# Altium schematic sheet Quadrature Mixers.SchDoc
size B; SheetNumber: 5; SheetTotal: 7
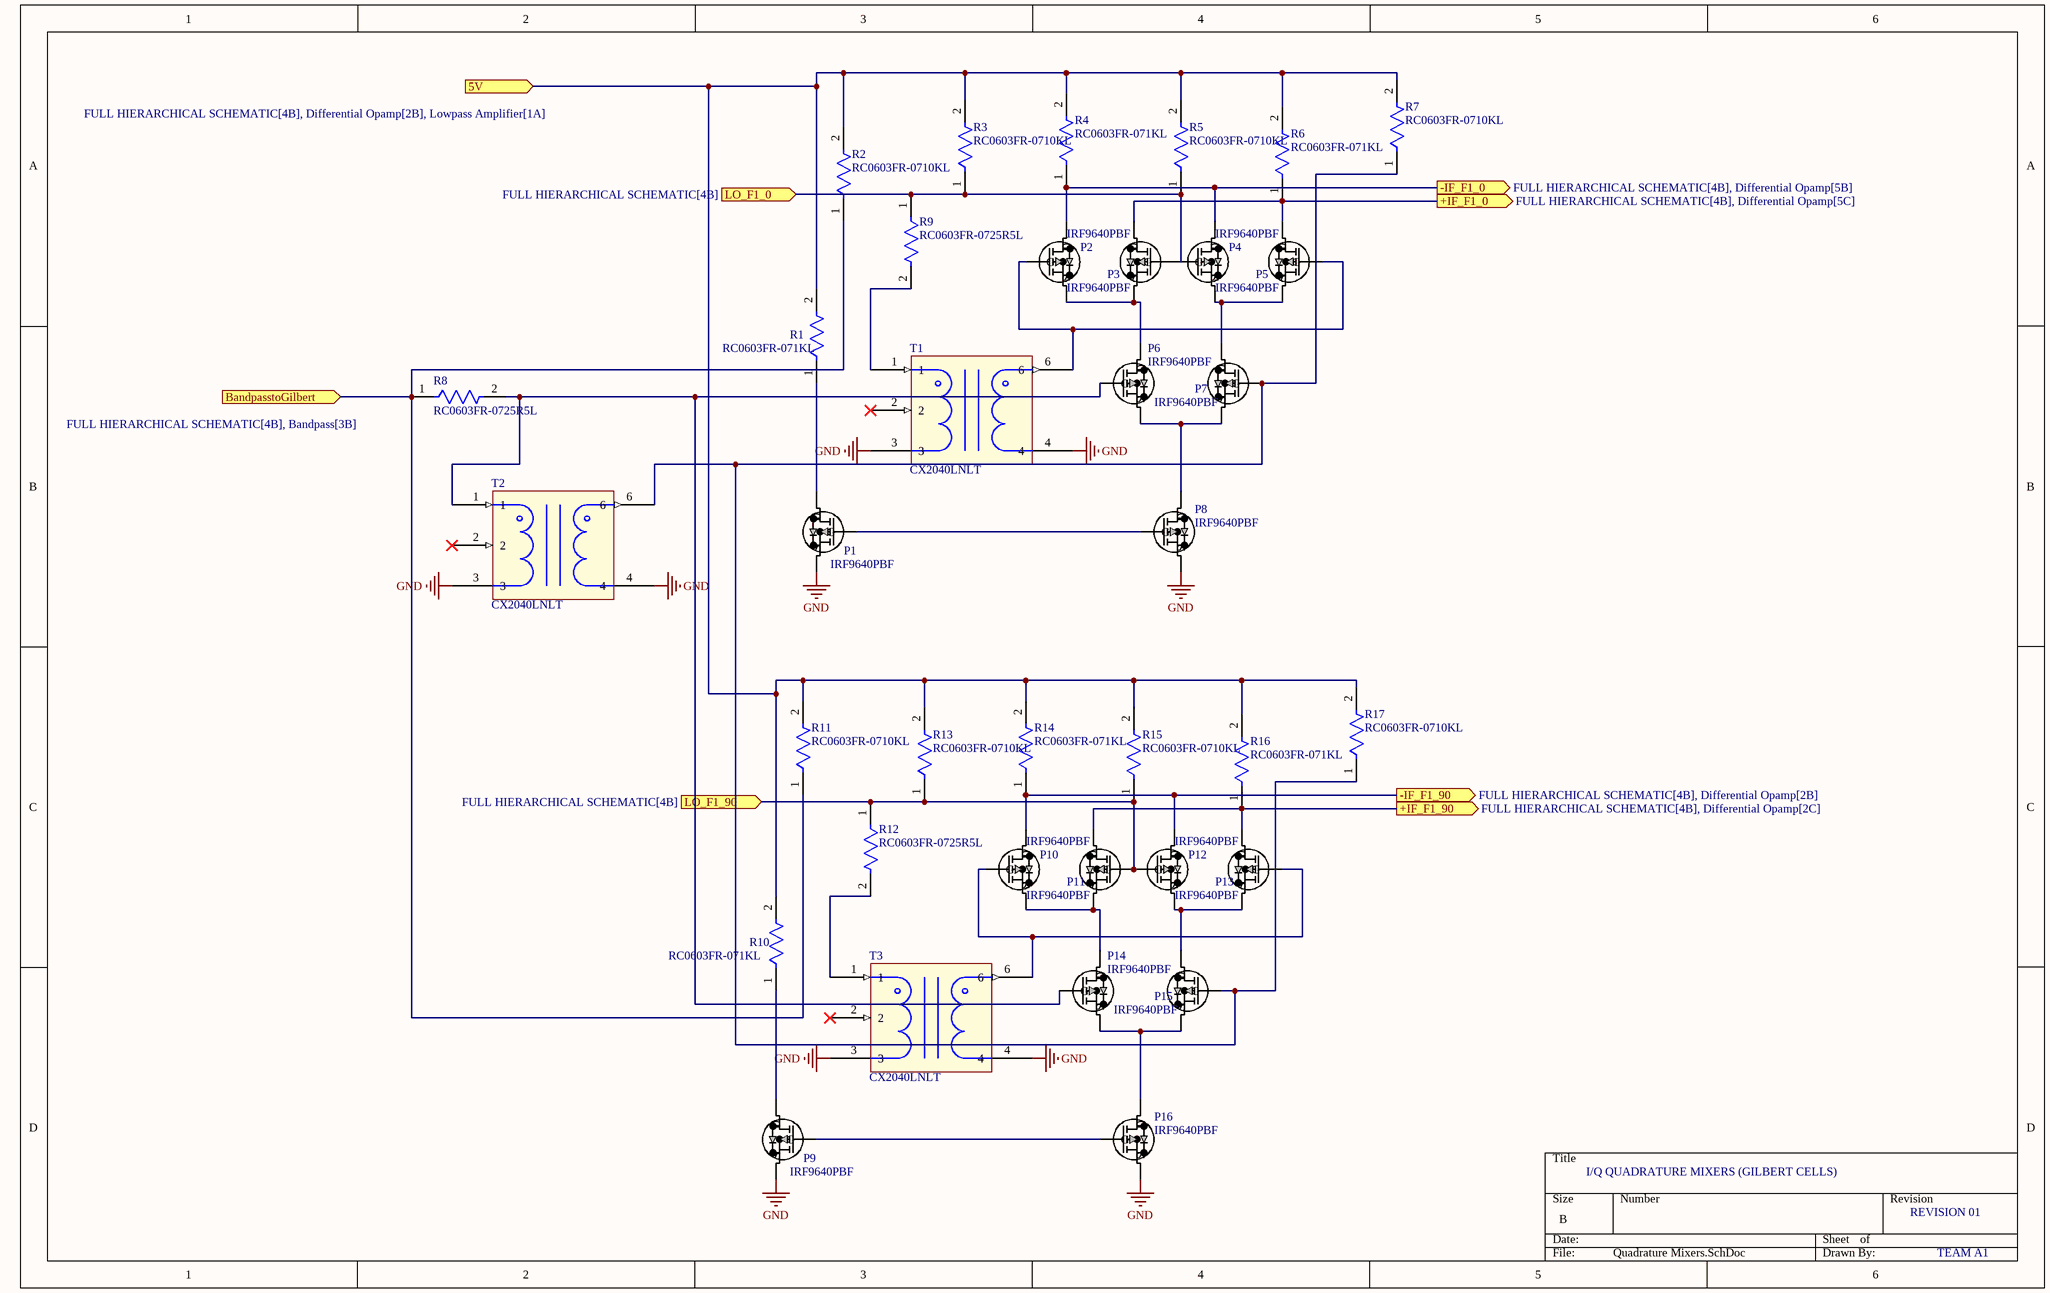
[diagram p0: Quadrature Mixers.SchDoc]

## Parts
P1  IRF9640PBF  [TO220AB_VIS]
P2  IRF9640PBF  [TO220AB_VIS]
P3  IRF9640PBF  [TO220AB_VIS]
P4  IRF9640PBF  [TO220AB_VIS]
P5  IRF9640PBF  [TO220AB_VIS]
P6  IRF9640PBF  [TO220AB_VIS]
P7  IRF9640PBF  [TO220AB_VIS]
P8  IRF9640PBF  [TO220AB_VIS]
P9  IRF9640PBF  [TO220AB_VIS]
P10  IRF9640PBF  [TO220AB_VIS]
P11  IRF9640PBF  [TO220AB_VIS]
P12  IRF9640PBF  [TO220AB_VIS]
P13  IRF9640PBF  [TO220AB_VIS]
P14  IRF9640PBF  [TO220AB_VIS]
P15  IRF9640PBF  [TO220AB_VIS]
P16  IRF9640PBF  [TO220AB_VIS]
R1  RC0603FR-071KL  [FP-RC0603-0_55-IPC_C]
R2  RC0603FR-0710KL  [FP-RC0603-0_55-IPC_C]
R3  RC0603FR-0710KL  [FP-RC0603-0_55-IPC_C]
R4  RC0603FR-071KL  [FP-RC0603-0_55-IPC_C]
R5  RC0603FR-0710KL  [FP-RC0603-0_55-IPC_C]
R6  RC0603FR-071KL  [FP-RC0603-0_55-IPC_C]
R7  RC0603FR-0710KL  [FP-RC0603-0_55-IPC_C]
R8  RC0603FR-0725R5L  [FP-RC0603-0_55-IPC_C]
R9  RC0603FR-0725R5L  [FP-RC0603-0_55-IPC_C]
R10  RC0603FR-071KL  [FP-RC0603-0_55-IPC_C]
R11  RC0603FR-0710KL  [FP-RC0603-0_55-IPC_C]
R12  RC0603FR-0725R5L  [FP-RC0603-0_55-IPC_C]
R13  RC0603FR-0710KL  [FP-RC0603-0_55-IPC_C]
R14  RC0603FR-071KL  [FP-RC0603-0_55-IPC_C]
R15  RC0603FR-0710KL  [FP-RC0603-0_55-IPC_C]
R16  RC0603FR-071KL  [FP-RC0603-0_55-IPC_C]
R17  RC0603FR-0710KL  [FP-RC0603-0_55-IPC_C]
T1  CX2040LNLT  [CX2040LNLT]
T2  CX2040LNLT  [CX2040LNLT]
T3  CX2040LNLT  [CX2040LNLT]

## Ports
5V (in, see FULL HIERARCHICAL SCHEMATIC[4B], Differential Opamp[2B], Lowpass Amplifier[1A]), +IF_F1_0 (out, see FULL HIERARCHICAL SCHEMATIC[4B], Differential Opamp[5C]), +IF_F1_90 (out, see FULL HIERARCHICAL SCHEMATIC[4B], Differential Opamp[2C]), -IF_F1_0 (out, see FULL HIERARCHICAL SCHEMATIC[4B], Differential Opamp[5B]), -IF_F1_90 (out, see FULL HIERARCHICAL SCHEMATIC[4B], Differential Opamp[2B]), BandpasstoGilbert (in, see FULL HIERARCHICAL SCHEMATIC[4B], Bandpass[3B]), LO_F1_0 (in, see FULL HIERARCHICAL SCHEMATIC[4B]), LO_F1_90 (in, see FULL HIERARCHICAL SCHEMATIC[4B])

## Nets
GND: P1.3(S) P8.3(S) P9.3(S) P16.3(S) T1.3 T1.4 T2.3 T2.4 T3.3 T3.4
5V: R1.2 R2.2 R3.2 R4.2 R5.2 R6.2 R7.2 R10.2 R11.2 R13.2 R14.2 R15.2 R16.2 R17.2 ; port 5V
+IF_F1_0: P3.2(D) P5.2(D) R6.1 ; port +IF_F1_0
+IF_F1_90: P11.2(D) P13.2(D) R16.1 ; port +IF_F1_90
-IF_F1_0: P2.2(D) P4.2(D) R4.1 ; port -IF_F1_0
-IF_F1_90: P10.2(D) P12.2(D) R14.1 ; port -IF_F1_90
BandpasstoGilbert: R2.1 R8.1 R11.1 ; port BandpasstoGilbert
LO_F1_0: R3.1 R5.1 R9.1 ; port LO_F1_0
LO_F1_90: P11.1(G) P12.1(G) R12.1 R13.1 R15.1 ; port LO_F1_90
NetP1_1: P1.1(G) P8.1(G)
NetP1_2: P1.2(D) R1.1
NetP2_1: P2.1(G) P5.1(G) T1.6
NetP2_3: P2.3(S) P3.3(S) P6.2(D)
NetP3_1: P3.1(G) P4.1(G)
NetP4_3: P4.3(S) P5.3(S) P7.2(D)
NetP6_1: P6.1(G) P14.1(G) R8.2 T2.1
NetP6_3: P6.3(S) P7.3(S) P8.2(D)
NetP7_1: P7.1(G) P15.1(G) R7.1 R17.1 T2.6
NetP9_1: P9.1(G) P16.1(G)
NetP9_2: P9.2(D) R10.1
NetP10_1: P10.1(G) P13.1(G) T3.6
NetP10_3: P10.3(S) P11.3(S) P14.2(D)
NetP12_3: P12.3(S) P13.3(S) P15.2(D)
NetP14_3: P14.3(S) P15.3(S) P16.2(D)
NetR9_2: R9.2 T1.1
NetR12_2: R12.2 T3.1

Not connected (* = marked no-connect by the designer): T1 2*; T2 2*; T3 2*

## Notes on the sheet
- I/Q QUADRATURE MIXERS (GILBERT CELLS)
- REVISION 01
- TEAM A1

## Library data of the parts
P1-P16 = IRF9640PBF: No Description Available; Mfr_Name: Vishay
R1 R4 R6 R8-R10 R12 R14 R16 = CMP-1659-00009-5: RES 1K OHM 1% 1/10W 0603; Resistance: 1kR; Voltage Rating: 50V; Power Rating: 100mW; Temperature Coefficient: 100ppm/°C; Military Standard: Not; REACH SVHC: No SVHC; Size Code: 0603; Features: Moisture Resistant; Number of Terminations: 2; Technology: THICK FILM; Series: RC; Case Code (Metric): 1608; Resistance Tolerance: 1%; Resistor Type: Thick Film; Termination: SMD/SMT; Contact Plating: Tin; Radiation Hardening: No; Min Operating Temperature: -55°C; Max Operating Temperature: 155°C; Packaging: Tape and Reel; Max Power Dissipation: 100mW; RoHS Compliant: Yes; Height: 0.45mm; Lead Free: Lead Free; Case/Package: 0603; Length: 1.6mm; Tolerance: 1%; Case Code (Imperial): 0603; Construction: Rectangular; Depth: 0.8mm
R2 R3 R5 R7 R11 R13 R15 R17 = CMP-2100-03664-2: RES 10K OHM 1% 1/10W 0603; Voltage Rating: 75V; Voltage Rating (DC): 50V; Resistance: 10kR; Power Rating: 100mW; Temperature Coefficient: 100ppm/°C; Depth: 0.8mm; Termination: SMD/SMT; Resistor Type: Thick Film; Series: RC; Construction: Rectangular; Features: Moisture Resistant; Packaging: Tape and Reel; Min Operating Temperature: -55°C; Number of Terminations: 2; Lead Pitch: 0.3mm; RoHS Compliant: Yes; Case/Package: 0603; Resistance Tolerance: 1%; Military Standard: Not; Weight: 7.1E-05oz; Number of Pins: 2; Tolerance: 1%; Length: 1.6mm; Case Code (Imperial): 0603; Lead Free: Lead Free; Width: 0.8mm; Max Power Dissipation: 100mW; Height: 0.45mm; Max Operating Temperature: 155°C; Case Code (Metric): 1608; Size Code: 0603
T1-T3 = CX2040LNLT: BALUN 1MHZ-500MHZ 75/75 5SMD MOD; Manufacturer: Pulse Electronics; Transformer Type: RF and Wireless Balun; Frequency Range: 1MHz ~ 500MHz; Insertion Loss (Max): 0.9dB; Manufacturer Part: CX2040LNLT; Length: 3.81mm; Depth: 3.81mm; RoHS Compliant: Yes; Package: 5-SMD Module; Mounting Type: Surface Mount; Max Operating Temperature: 85 °C; Min Operating Temperature: -40 °C; Number of Pins: 5